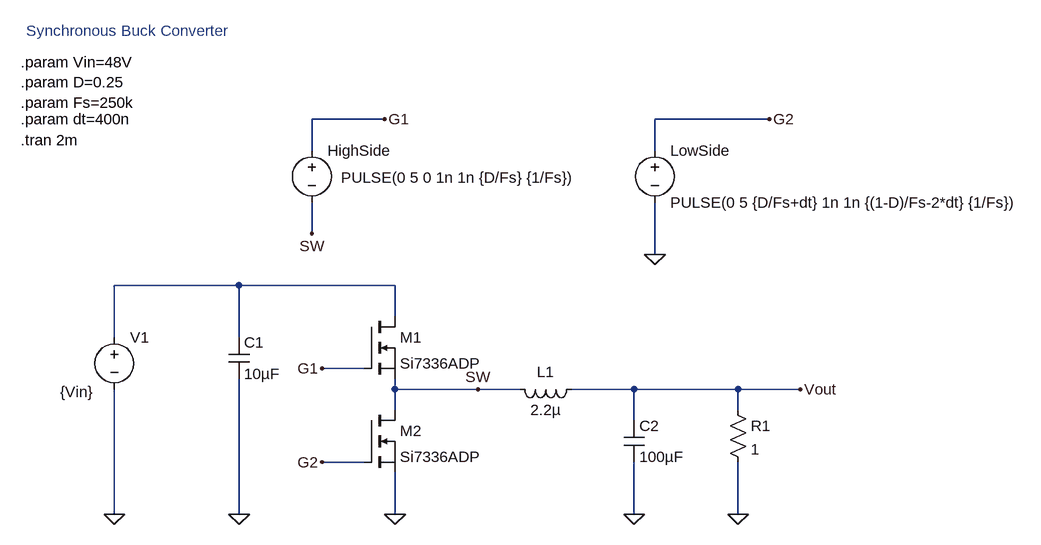
[diagram p0: schematic buck_converter.asc]
buck_converter.asc, the LTspice schematic file:
Version 4
SHEET 1 1660 680
WIRE 592 -128 480 -128
WIRE 1184 -128 1008 -128
WIRE 480 -80 480 -128
WIRE 1008 -80 1008 -128
WIRE 480 48 480 0
WIRE 1008 80 1008 0
WIRE 368 128 176 128
WIRE 608 128 368 128
WIRE 608 176 608 128
WIRE 176 208 176 128
WIRE 368 208 368 128
WIRE 560 256 496 256
WIRE 608 288 608 272
WIRE 736 288 608 288
WIRE 800 288 736 288
WIRE 976 288 880 288
WIRE 1136 288 976 288
WIRE 1232 288 1136 288
WIRE 608 320 608 288
WIRE 1136 320 1136 288
WIRE 976 336 976 288
WIRE 560 400 496 400
WIRE 176 480 176 288
WIRE 368 480 368 272
WIRE 608 480 608 416
WIRE 976 480 976 400
WIRE 1136 480 1136 400
FLAG 176 480 0
FLAG 368 480 0
FLAG 976 480 0
FLAG 1136 480 0
FLAG 1232 288 Vout
FLAG 736 288 SW
FLAG 608 480 0
FLAG 496 256 G1
FLAG 496 400 G2
FLAG 480 48 SW
FLAG 592 -128 G1
FLAG 1184 -128 G2
FLAG 1008 80 0
SYMBOL voltage 176 192 R0
WINDOW 3 -83 100 Left 2
WINDOW 123 0 0 Left 0
WINDOW 39 0 0 Left 0
SYMATTR Value {Vin}
SYMATTR InstName V1
SYMBOL cap 352 208 R0
SYMATTR InstName C1
SYMATTR Value 10µF
SYMBOL nmos 560 176 R0
SYMATTR InstName M1
SYMATTR Value Si7336ADP
SYMBOL nmos 560 320 R0
SYMATTR InstName M2
SYMATTR Value Si7336ADP
SYMBOL ind 896 272 R90
WINDOW 0 5 56 VBottom 2
WINDOW 3 32 56 VTop 2
SYMATTR InstName L1
SYMATTR Value 2.2µ
SYMBOL cap 960 336 R0
SYMATTR InstName C2
SYMATTR Value 100µF
SYMBOL res 1120 304 R0
SYMATTR InstName R1
SYMATTR Value 1
SYMBOL voltage 480 -96 R0
WINDOW 3 45 58 Left 2
WINDOW 123 0 0 Left 0
WINDOW 39 0 0 Left 0
SYMATTR Value PULSE(0 5 0 1n 1n {D/Fs} {1/Fs})
SYMATTR InstName HighSide
SYMBOL voltage 1008 -96 R0
WINDOW 123 0 0 Left 0
WINDOW 39 0 0 Left 0
SYMATTR InstName LowSide
SYMATTR Value PULSE(0 5 {D/Fs+dt} 1n 1n {(1-D)/Fs-2*dt} {1/Fs})
TEXT 40 -264 Left 2 ;Synchronous Buck Converter
TEXT 32 -216 Left 2 !.param Vin=48V\n.param D=0.25\n.param Fs=250k
TEXT 32 -96 Left 2 !.tran 2m
TEXT 32 -128 Left 2 !.param dt=400n

The netlist it stands for:
* buck_converter.asc
V1 N001 0 {Vin}
C1 N001 0 10µF
M1 N001 G1 SW SW Si7336ADP
M2 SW G2 0 0 Si7336ADP
L1 Vout SW 2.2µ
C2 Vout 0 100µF
R1 Vout 0 1
V§HighSide G1 SW PULSE(0 5 0 1n 1n {D/Fs} {1/Fs})
V§LowSide G2 0 PULSE(0 5 {D/Fs+dt} 1n 1n {(1-D)/Fs-2*dt} {1/Fs})
.model NMOS NMOS
.model PMOS PMOS
.lib standard.mos
* Synchronous Buck Converter
.param Vin=48V
.param D=0.25
.param Fs=250k
.tran 2m
.param dt=400n
.backanno
.end